# EasyEDA Pro project motor_driver.eprj

# Schematic Schematic1
Board Name: Board1; Create Date: 2025-08-01; Page Name: P1; Project Name: motor_driver; Schematic Name: Schematic1; Update Date: 2025-08-02; Company: EasyEDA.com; Page Size: A4; Version: V1.0
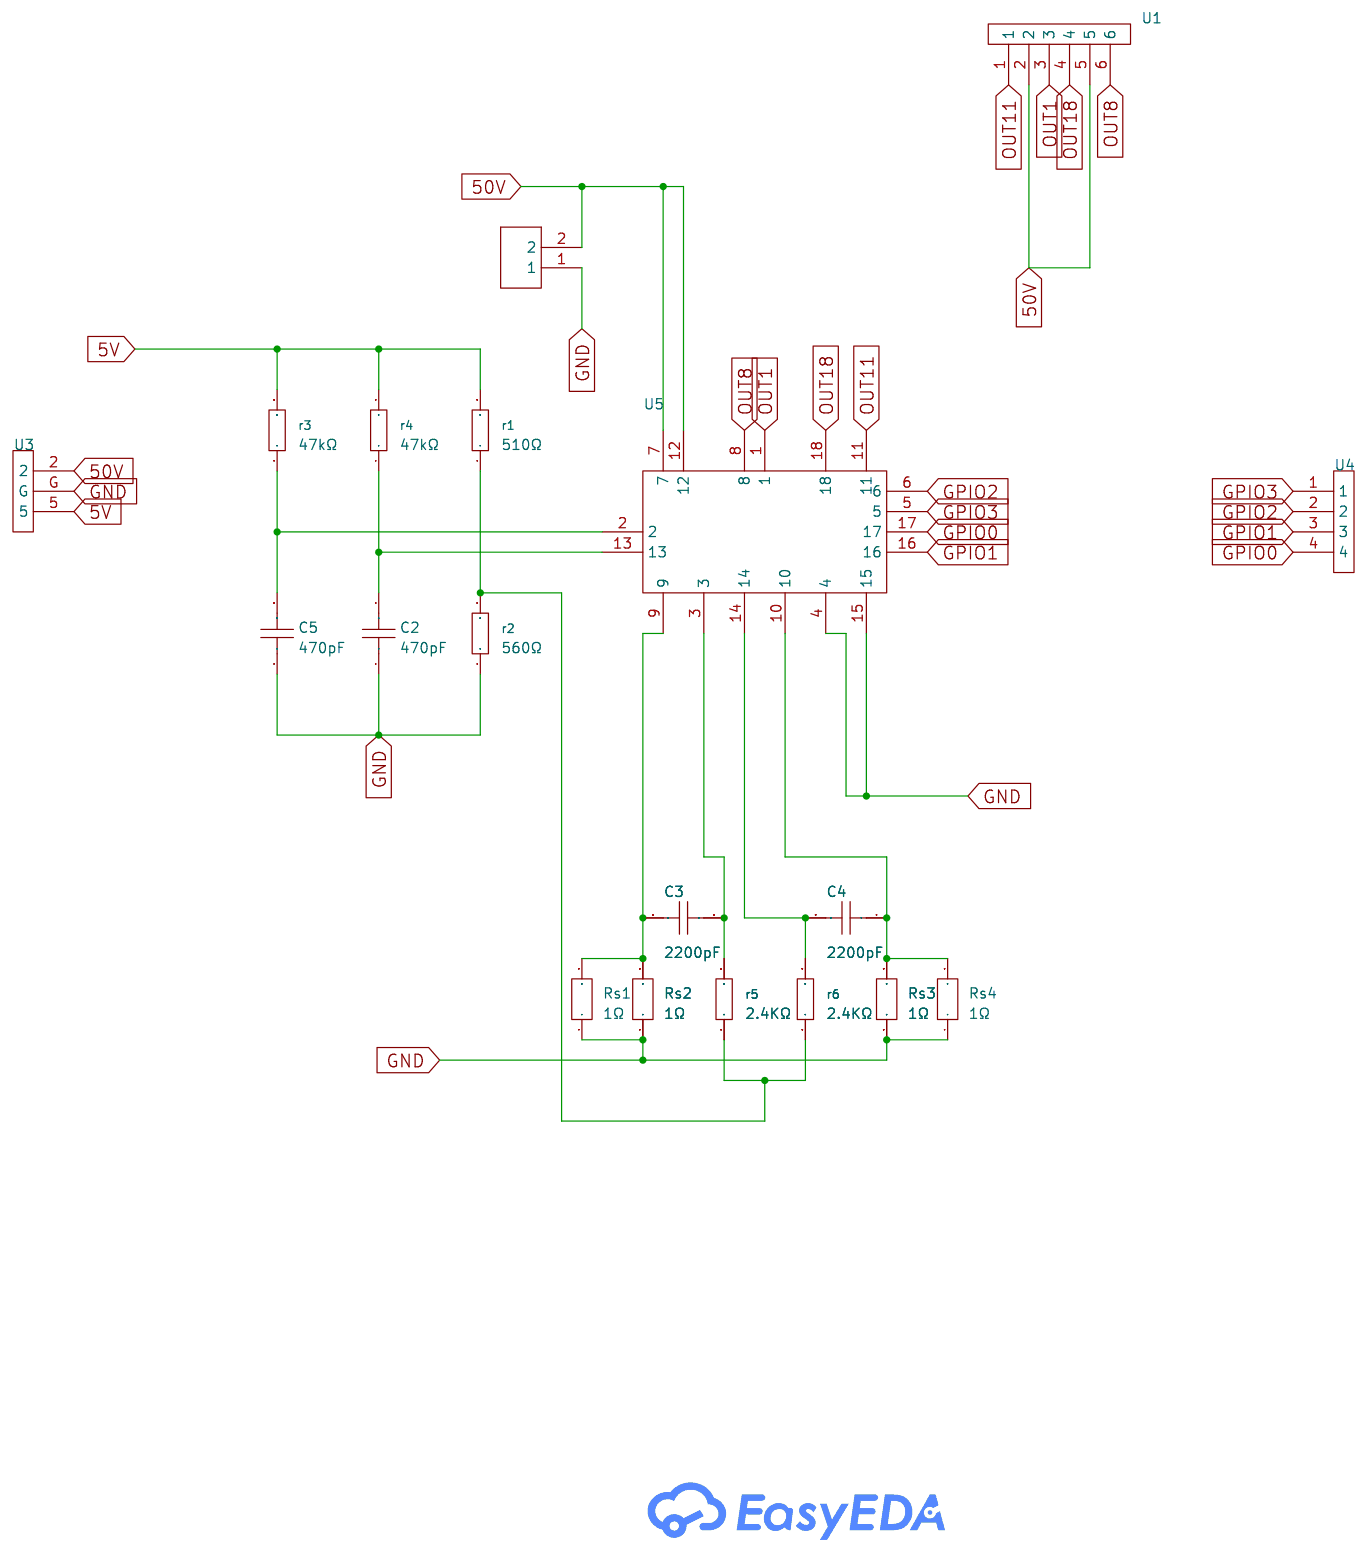
[diagram p0: schematic sheet]

## Parts
C1  -  [100uF Capacitor]
C2  470pF  [C0603]
C3  2200pF  [C0603]
C4  2200pF  [C0603]
C5  470pF  [C0603]
r1  510Ω  [R0603]
r2  560Ω  [R0603]
r3  47kΩ  [R0603]
r4  47kΩ  [R0603]
r5  2.4KΩ  [R0603]
r6  2.4KΩ  [R0603]
Rs1  1Ω  [R2512]
Rs2  1Ω  [R2512]
Rs3  1Ω  [R2512]
Rs4  1Ω  [R2512]
U1  -  [6pin]
U3  -  [3_waper]
U4  -  [4pin]
U5  -  [SLA7026M]

## Library data of the parts
C1 = 100uF Capacitor
C2-C5 = CL10Y225KA96PNC: LCSC Part Name: 2.2uF ±10% 25V; Supplier Part: C16193991; Manufacturer: SAMSUNG(三星); Supplier Footprint: 1608; JLCPCB Part Class: Extended Part; Datasheet: https://atta.szlcsc.com/upload/public/pdf/source/20241016/343E6C5D40C00C9E500791E8A384DD97.pdf; Supplier: LCSC; Tolerance: ±10%; Voltage Rating: 25V; Temperature Coefficient: X7S
r1-r6 = 0603WAF1005T5E: LCSC Part Name: 10MΩ ±1% 100mW 厚膜电阻; Supplier Part: C7250; Manufacturer: UNI-ROYAL(厚声); Supplier Footprint: 0603; JLCPCB Part Class: Basic Part; Datasheet: https://atta.szlcsc.com/upload/public/pdf/source/20200306/C422600_1E6D84923E4A46A82E41ADD87F860B5C.pdf; Supplier: LCSC; Type: Thick Film Resistors; Tolerance: ±1%; Temperature Coefficient: ±100ppm/℃; Operating Temperature Range: -55℃~+155℃
Rs1-Rs4 = HoYLR2512-2W-50mR-1%: LCSC Part Name: 50mΩ ±1% 2W; Supplier Part: C5375430; Manufacturer: Milliohm(毫欧); Supplier Footprint: 2512; JLCPCB Part Class: Extended Part; Datasheet: https://atta.szlcsc.com/upload/public/pdf/source/20230506/030C75DA7C4694D1A0A3C5A1E352E2F2.pdf; Supplier: LCSC; Type: Current Sensing Resistors; Tolerance: ±1%; Mounting Sytle: Patch
U1 = 6pin
U3 = 3_waper
U4 = 4pin
U5 = SLA7026M

## Nets
5V: r1.2 r3.2 r4.2 U3.5
50V: C1.2 U1.2 U1.5 U3.2 U5.7 U5.12
GND: C1.1 C2.1 C5.1 r2.1 Rs1.1 Rs2.1 Rs3.1 Rs4.1 U3.G U5.4 U5.15
GPIO0: U4.4 U5.17
GPIO1: U4.3 U5.16
GPIO2: U4.2 U5.6
GPIO3: U4.1 U5.5
OUT1: U1.3 U5.1
OUT8: U1.6 U5.8
OUT11: U1.1 U5.11
OUT18: U1.4 U5.18
$1N1679: C5.2 r3.1 U5.2
$1N1722: C2.2 r4.1 U5.13
$1N3278: C4.2 r6.2 U5.14
$1N3283: C4.1 Rs3.2 Rs4.2 U5.10
$1N3876: r1.1 r2.2 r5.1 r6.1
$1N3952: C3.1 r5.2 U5.3
$1N4263: C3.2 Rs1.2 Rs2.2 U5.9

# Board PCB1
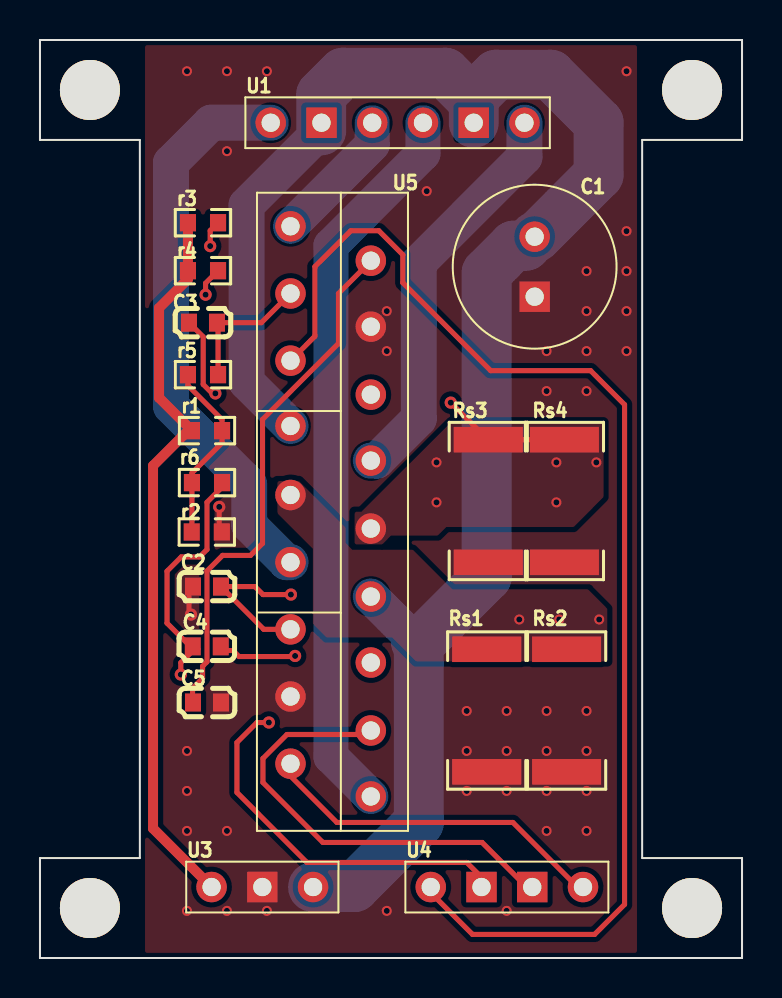
[diagram p1: board, top side]
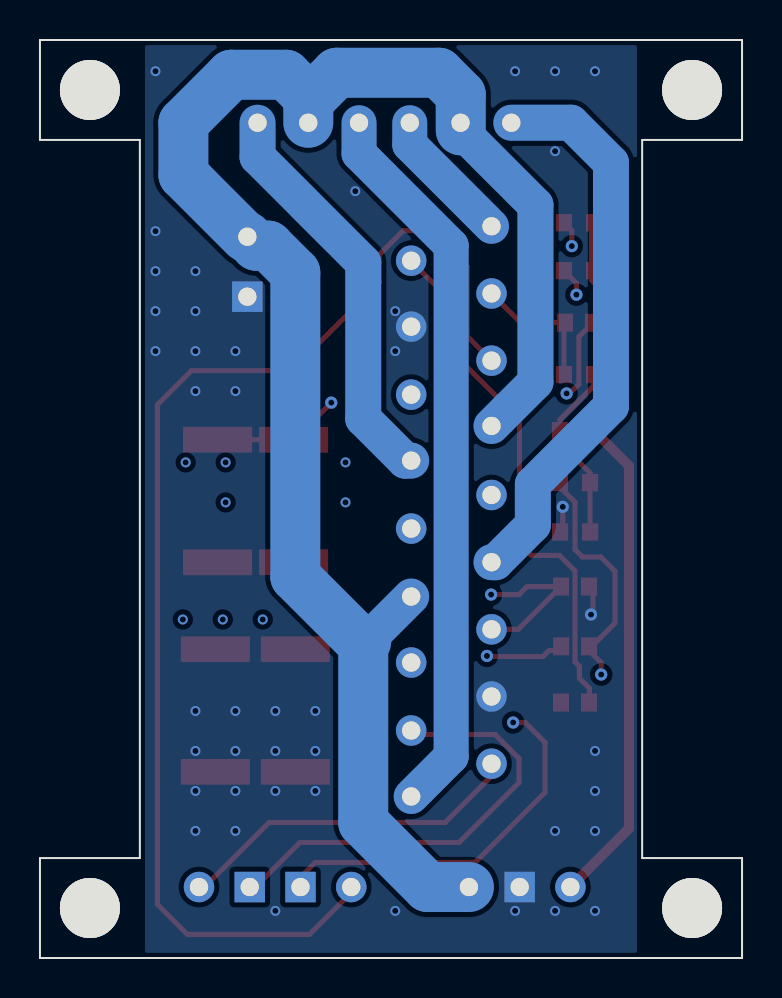
[diagram p2: board, bottom side, seen from below]

Outline 35.14 x 45.92 mm; copper layers: Top Layer, Inner1, Inner2, Bottom Layer. Coordinates in mm from the lower left corner of the outline.
Outline path: 0,45.92 35.14,45.92 35.14,40.92 30.14,40.92 30.14,5 35.14,5 35.14,0 0,0 0,5 5,5 5,40.92 0,40.92 0,45.92
Stack: Top Layer 0.035mm Outer layer thickness 1oz / Dielectric1 0.2104mm 7628 RC49% 8.6mil / Inner1 0.0152mm Inner layer thickness / Dielectric2 1.065mm 1.1mm H/HOZ Copper / Inner2 0.0152mm Inner layer thickness / Dielectric3 0.2104mm 7628 RC49% 8.6mil / Bottom Layer 0.035mm Outer layer thickness 1oz

## Design rules (mm)
template: Custom Config
spacing copperThickness1oz (default): track to track 0.102, other pairs 0.152 to 0.3
spacing copperThickness2oz: track to track 0.203, other pairs 0.152 to 0.3
track width copperThickness1oz (default): min 0.127, default 0.254, max 2.54
track width copperThickness2oz: min 0.203, default 0.254, max 2.54
differential pair differentialPair (default): width min 0.127, default 0.254, max 2.54; gap min 0.152, default 0.152
via viaSize (default): diameter min 0.5, default 0.61, max 10; hole min 0.3, default 0.305, max 6.3

## Placement (name value [footprint] x y rotation side)
C1  -  [100uF Capacitor]  24.76 34.58 90 top
C2  470pF  [C0603]  8.36 18.58 0 top
C3  2200pF  [C0603]  8.16 31.78 180 top
C4  2200pF  [C0603]  8.35 15.59 180 top
C5  470pF  [C0603]  8.36 12.78 180 top
NOREF  -  [Pad_e112]  2.5 2.5 0 top
NOREF#2  -  [Pad_e26]  32.64 43.42 0 top
NOREF#3  -  [Pad_e114]  32.64 2.5 0 top
NOREF#4  -  [Pad_e14]  2.5 43.42 0 top
r1  510Ω  [R0603]  8.36 26.38 180 top
r2  560Ω  [R0603]  8.35 21.31 180 top
r3  47kΩ  [R0603]  8.16 36.78 180 top
r4  47kΩ  [R0603]  8.16 34.38 180 top
r5  2.4KΩ  [R0603]  8.16 29.18 0 top
r6  2.4KΩ  [R0603]  8.36 23.78 0 top
Rs1  1Ω  [R2512]  22.36 12.38 90 top
Rs2  1Ω  [R2512]  26.36 12.38 90 top
Rs3  1Ω  [R2512]  22.44 22.86 90 top
Rs4  1Ω  [R2512]  26.25 22.86 90 top
U1  -  [6pin]  15.36 41.78 0 top
U3  -  [3_waper]  9.86 2.28 0 top
U4  -  [4pin]  23.37 3.55 0 top
U5  -  [SLA7026M]  10.86 38.28 270 top

## Footprints (pads in the part's own frame, mm; a bottom-side part is the same pattern mirrored in y, then rotated)
3_waper
  round 1.524 hole 0.914: 2(3.81,1.27) 5(-1.27,1.27)
  rect 1.524x1.524 hole 0.914: G(1.27,1.27)
4pin
  round 1.524 hole 0.914: 1(-3.81,0) 4(3.81,0)
  rect 1.524x1.524 hole 0.914: 2(-1.27,0) 3(1.27,0)
6pin
  round 1.524 hole 0.914: 1(-3.81,0) 3(1.27,0) 4(3.81,0) 6(8.89,0)
  rect 1.524x1.524 hole 0.914: 2(-1.27,0) 5(6.35,0)
100uF Capacitor
  rect 1.524x1.524 hole 0.914: 1(-1.5,0)
  round 1.524 hole 0.914: 2(1.5,0)
C0603
  rect 0.8x0.9 smd: 1(-0.7,0) 2(0.7,0)
Pad_e14
  round 3 hole 3: 1(0,0)
Pad_e26
  round 3 hole 3: 1(0,0)
Pad_e112
  round 3 hole 3: 1(0,0)
Pad_e114
  round 3 hole 3: 1(0,0)
R0603
  rect 0.806x0.864 smd: 1(-0.753,0) 2(0.753,0)
R2512
  rect 1.282x3.456 smd: 1(-3.067,0) 2(3.067,0)
SLA7026M
  round 1.524 hole 0.914: 1(1.68,1.68) 2(3.4,5.7) 3(5.04,1.68) 4(6.7,5.7) 5(8.4,1.68) 6(10.1,5.7) 7(11.667,1.68) 8(13.4,5.7) 9(15.12,1.68) 10(16.8,5.7) 11(18.48,1.68) 12(20.2,5.7) 13(21.84,1.68) 14(23.5,5.7) 15(25.2,1.68) 16(26.9,5.7) 17(28.56,1.68) 18(30.2,5.7)

## Nets
As in the schematic.

Pads without a net: NOREF 1; NOREF#2 1; NOREF#3 1; NOREF#4 1

## Via types
v1: diameter 0.5, hole 0.305, Top Layer to Bottom Layer, 49 vias
v2: diameter 0.61, hole 0.305, Top Layer to Bottom Layer, 10 vias

## Routing (per net, layer and track width the routed paths; a pad name or vN(x,y) marks a point on that pad's centre or on a via; arc(x,y) is an arc through that point)
5V: length 36.6
  Top Layer w0.5: r3.2 r4.2 7.41,33.96 5.96,32.51 5.96,28.03 r1.2 7.42,26.38 5.66,24.62 5.66,6.48 U3.5
50V: length 85.6
  Bottom Layer w1.8: U5.12 18.81,15.83 ; U5.7 10.34,28.81 10.34,37.66 14.08,41.4
  Bottom Layer w2.5: 24.86,36.08 27.96,39.18 27.96,41.78 25.56,44.18 22.83,44.18 21.71,43.06 ; 14.08,41.4 14.08,43.19 15.17,44.28 20.28,44.28 21.71,42.85 U1.5 ; U3.2 15.73,3.55 18.96,6.78 18.96,15.68 19.11,15.83 ; C1.2 24.31,35.63 23.71,35.63 22.36,34.28 22.36,19.08 19.11,15.83 ; 18.81,15.83 19.11,15.83
GND: length 2.7
  Top Layer w0.254: 9.11,21.38 8.97,21.52 v2(8.97,22.57) ; v2(7.56,17.18) 7.46,17.28 7.46,18.58
  vias: v1(7.36,44.36) v1(7.36,10.36) v1(7.36,8.36) v1(7.36,6.36) v1(7.36,2.36) v1(9.36,44.36) v1(9.36,40.36) v1(9.36,6.36) v1(9.36,2.36) v1(11.36,44.36) v1(11.36,2.36) v1(17.36,32.36) v1(17.36,30.36) v1(17.36,2.36) v1(19.36,38.36) v1(21.36,12.36) v1(21.36,10.36) v1(21.36,8.36) v1(23.36,12.36) v1(23.36,10.36) v1(23.36,8.36) v1(23.36,2.36) v1(25.36,30.36) v1(25.36,28.36) v1(25.36,12.36) v1(25.36,10.36) v1(25.36,8.36) v1(25.36,6.36) v1(27.36,34.36) v1(27.36,32.36) v1(27.36,30.36) v1(27.36,28.36) v1(27.36,12.36) v1(27.36,10.36) v1(27.36,8.36) v1(27.36,6.36) v1(29.36,44.36) v1(29.36,36.36) v1(29.36,34.36) v1(29.36,32.36) v1(29.36,30.36)
GPIO0: length 17.7
  Top Layer w0.254: 27.17,3.28 23.67,6.78 14.86,6.78 12.54,9.1 U5.17
GPIO1: length 22.9
  Top Layer w0.254: U5.16 16.36,11.18 12.36,11.18 11.16,9.98 11.16,8.78 14.16,5.78 22.13,5.78 24.63,3.28
GPIO2: length 41
  Top Layer w0.254: v2(11.46,11.78) 10.86,11.78 9.86,10.78 9.86,8.28 13.36,4.78 21.36,4.78 22.09,4.05 22.09,3.28
  Inner2 w0.254: U5.6 16.96,28.18 18.16,26.98 18.16,17.18 17.36,16.38 16.16,16.38 14.76,14.98 14.76,13.38 13.16,11.78 v2(11.46,11.78)
GPIO3: length 62.1
  Top Layer w0.254: 19.55,3.28 21.65,1.18 27.76,1.18 29.26,2.68 29.26,27.68 27.56,29.38 22.56,29.38 18.16,33.78 18.16,35.18 16.96,36.38 15.56,36.38 13.76,34.58 13.76,31.1 U5.5
OUT1: length 6.9
  Bottom Layer w1.75: U5.1 16.63,40.69 U1.3
OUT8: length 20.3
  Bottom Layer w1.8: U5.8 16.86,24.88 18.96,26.98 18.96,34.78 24.25,40.07 U1.6
OUT11: length 28.4
  Bottom Layer w1.8: U1.1 8.56,41.78 6.56,39.78 6.56,27.6 10.47,23.69 10.47,21.67 12.34,19.8 U5.11
OUT18: length 36.4
  Bottom Layer w1.75: U5.18 14.56,10.08 14.56,35.63 19.17,40.24 U1.4
$1N1679: length 36.3
  Top Layer w0.254: r3.1 8.52,36.39 v2(8.52,35.61) ; C5.2 7.64,12.8 7.64,13.5 8.14,14 8.14,14.6 8.36,14.82 8.36,19.36 9.14,20.14 10.54,20.14 11.14,20.74 11.14,26.94 14.94,30.74 14.94,33.24 16.56,34.86 U5.2
  Inner1 w0.254: v2(8.52,35.61) 10.13,35.61 10.76,34.98 16.46,34.98 U5.2
$1N1722: length 31.1
  Top Layer w0.254: v2(12.56,18.18) 11.16,18.18 10.76,18.58 C2.2 11.2,16.44 U5.13 ; v2(8.29,33.18) 8.29,33.76 r4.1
  Inner2 w0.254: v2(12.56,18.18) 11.16,19.58 11.16,20.18 12.36,21.38 13.36,21.38 14.16,22.18 14.16,27.38 13.16,28.38 11.96,28.38 10.76,29.58 10.76,32.49 10.07,33.18 v2(8.29,33.18)
$1N3278: length 26.4
  Top Layer w0.254: v2(7.05,14.18) 7.05,14.77 7.66,15.38 ; r6.2 9.11,23.55 8.36,22.8 8.36,20.44 7.99,20.06 7.07,20.06 6.36,19.35 6.36,16.75 7.67,15.44 7.9,15.44
  Inner1 w0.254: v2(7.05,14.18) 9.39,14.18 10.55,13.02 10.55,11.4 10.95,11 14.19,11 16.59,13.4 16.59,14.75 U5.14
$1N3283: length 31.7
  Top Layer w0.254: v2(12.77,15.11) 12.74,15.08 9.96,15.08 9.66,15.38 9.06,15.38 ; Rs4.2 Rs3.2 22.41,25.93 v2(20.56,27.78)
  Inner2 w0.254: v2(20.56,27.78) 18.56,29.78 15.96,29.78 14.96,28.78 14.96,17.3 v2(12.77,15.11)
  vias: v1(19.85,24.79) v1(19.85,22.79) v1(25.85,24.79) v1(25.85,22.79) v1(27.85,24.79)
$1N3876: length 9.1
  Top Layer w0.254: 7.61,21.38 r6.1 7.61,24.26 9.11,25.77 r1.1 9.11,26.93 7.41,28.64 r5.1
$1N3952: length 6.9
  Top Layer w0.254: U5.3 11.08,31.78 C3.1 8.91,31.73 r5.2
$1N4263: length 11.5
  Top Layer w0.254: C3.2 8.17,31.07 8.17,28.69 8.62,28.24 v2(8.78,28.24)
  Inner2 w0.254: U5.9 11.16,24.54 11.16,26.98 9.9,28.24 v2(8.78,28.24)
  vias: v1(23.99,16.93) v1(25.99,16.93) v1(27.99,16.93)

## Copper pours and planes (outline as drawn; the poured copper is in the pictures)
GND on Top Layer: 3.26,47.48 31.96,47.48 31.96,-1.62 3.26,-1.62
GND on Bottom Layer: 3.16,47.68 32.06,47.68 32.06,-1.62 3.16,-1.62
GND on Inner1: 3.26,47.98 32.26,47.98 32.26,-1.72 3.26,-1.72
GND on Inner2: 3.26,47.88 32.36,47.88 32.36,-1.62 3.26,-1.62
$1N3283 on Top Layer: 15.75,22.32 15.75,20.71 15.73,20.69 17.09,20.69 17.11,20.67 17.57,21.13 19.91,21.13 20.34,21.56 26.71,21.56 28.21,23.06 28.21,26.8 20.57,26.8 16.09,22.32
$1N3283 on Inner1: 15.82,22.32 15.82,20.71 15.83,20.7 17.06,20.7 17.56,21.2 19.98,21.2 20.39,21.61 26.66,21.61 28.17,23.12 28.17,26.77 28.2,26.8 20.48,26.8 16.01,22.32
$1N4263 on Top Layer: 11.89,23.84 11.89,22.28 11.87,22.26 13.66,20.47 13.66,16.72 14.34,16.03 17.63,16.03 18.83,14.83 28.4,14.83 28.4,17.47 27.46,18.41 27.46,18.44 20.64,18.44 18.66,20.42 15.63,20.42 15.3,20.76 15.3,21.52 12.96,23.86 11.87,23.86
$1N4263 on Inner1: 11.76,23.94 11.76,22.41 13.71,20.46 13.71,16.71 14.34,16.08 17.59,16.08 18.75,14.92 28.32,14.92 28.32,17.47 27.39,18.4 20.54,18.4 18.6,20.34 15.58,20.34 15.23,20.69 15.23,21.38 12.67,23.94 11.76,23.94
